# Altium schematic sheet 01_MCU.SchDoc
size A4
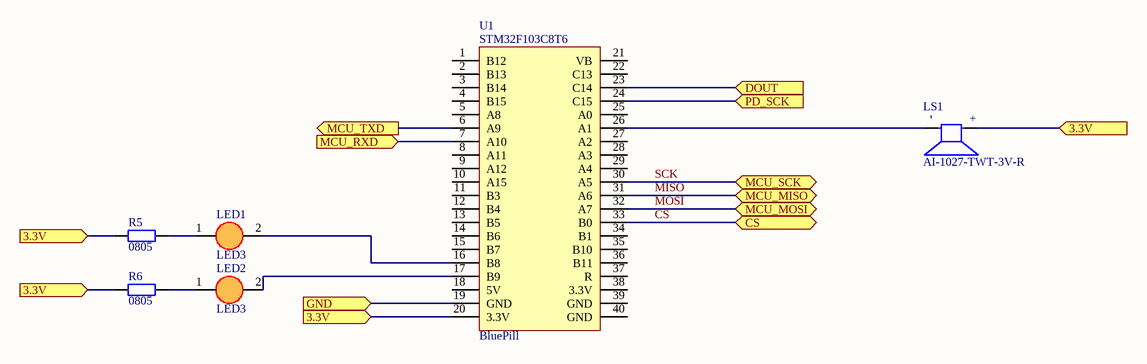
[diagram p0: 01_MCU.SchDoc]

## Parts
LED1  LED3  [LED3mm]
LED2  LED3  [LED3mm]
LS1  AI-1027-TWT-3V-R  [XDCR_AI-1027-TWT-3V-R]
R5  value 0805  [DIEN TRO 0805]  (hidden comment: R0805)
R6  value 0805  [DIEN TRO 0805]  (hidden comment: R0805)
U1  BluePill  [DIP40 - duplicate]

## Ports
3.3V (in), CS (bidir), DOUT (in), GND (in), MCU_MISO (bidir), MCU_MOSI (bidir), MCU_RXD (in), MCU_SCK (bidir), MCU_TXD (out), PD_SCK (in)

## Nets
3.3V: LS1.P R5.1 R6.1 U1.20(3.3V) ; port 3.3V
CS: U1.33(B0) ; port CS
DOUT: U1.23(C14) ; port DOUT
GND: U1.19(GND) ; port GND
MCU_RXD: U1.7(A10) ; port MCU_RXD
MCU_TXD: U1.6(A9) ; port MCU_TXD
MISO: U1.31(A6) ; port MCU_MISO
MOSI: U1.32(A7) ; port MCU_MOSI
PD_SCK: U1.24(C15) ; port PD_SCK
SCK: U1.30(A5) ; port MCU_SCK
NetLED1_1: LED1.1(A) R5.2
NetLED1_2: LED1.2(K) U1.16(B8)
NetLED2_1: LED2.1(A) R6.2
NetLED2_2: LED2.2(K) U1.17(B9)
NetLS1_N: LS1.N U1.26(A1)

Not connected (* = marked no-connect by the designer): U1 1(B12) 2(B13) 3(B14) 4(B15) 5(A8) 8(A11) 9(A12) 10(A15) 11(B3) 12(B4) 13(B5) 14(B6) 15(B7) 18(5V) 21(VB) 22(C13) 25(A0) 27(A2) 28(A3) 29(A4) 34(B1) 35(B10) 36(B11) 37(R) 38(3.3V) 39(GND) 40(GND)

## Notes on the sheet
- Project:
- MANDevices
- Page Contents:
- Size:
- Date:
- A4
- Checked by:
- Time:
- Revision:
- Sheet
- of
- HaNoi University of
- Science and Technology
- File:
- (in symbol AI-1027-TWT-3V-R) -; +
- (in symbol BluePill) STM32F103C8T6

## Library data of the parts
LED1 LED2 = LED 3mm
LS1 = AI-1027-TWT-3V-R: Buzzers Indicator, Internally Driven Electromechanical/Magnetic 3V 30mA 2.7kHz 80dB @ 3V, 10cm Through Hole PC Pins; MF: PUI Audio, Inc.; Price: None; SnapEDA_Link: https://www.snapeda.com/parts/AI-1027-TWT-3V-R/PUI%20Audio,%20Inc./view-part/7376009/?ref=snap; Purchase-URL: https://pricing.snapeda.com/search/part/AI-1027-TWT-3V-R/?ref=eda; Check_prices: https://www.snapeda.com/parts/AI-1027-TWT-3V-R/PUI%20Audio,%20Inc./view-part/7376009/?ref=eda; Value: *; MP: AI-1027-TWT-3V-R; Package: None; Availability: In Stock
R5 R6 = R0805: Resistor SMD 0805; Published: 8-Jun-2000; LatestRevisionDate: 17-Jul-2002; LatestRevisionNote: Re-released for DXP Platform.; PackageReference: AXIAL-0.4; Publisher: Altium Limited